# EasyEDA Pro project ProProject_ESP32-S3语音识别测试板_2023-11-30.epro

# Schematic S3版本验证-SCH
Create Date: 2023-11-21; Page Name: P1; Project Name: 物联网开关; Schematic Name: S3版本验证-SCH; Update Date: 2023-11-21; Drawed: Diam; Page Size: A4; Version: V1.0
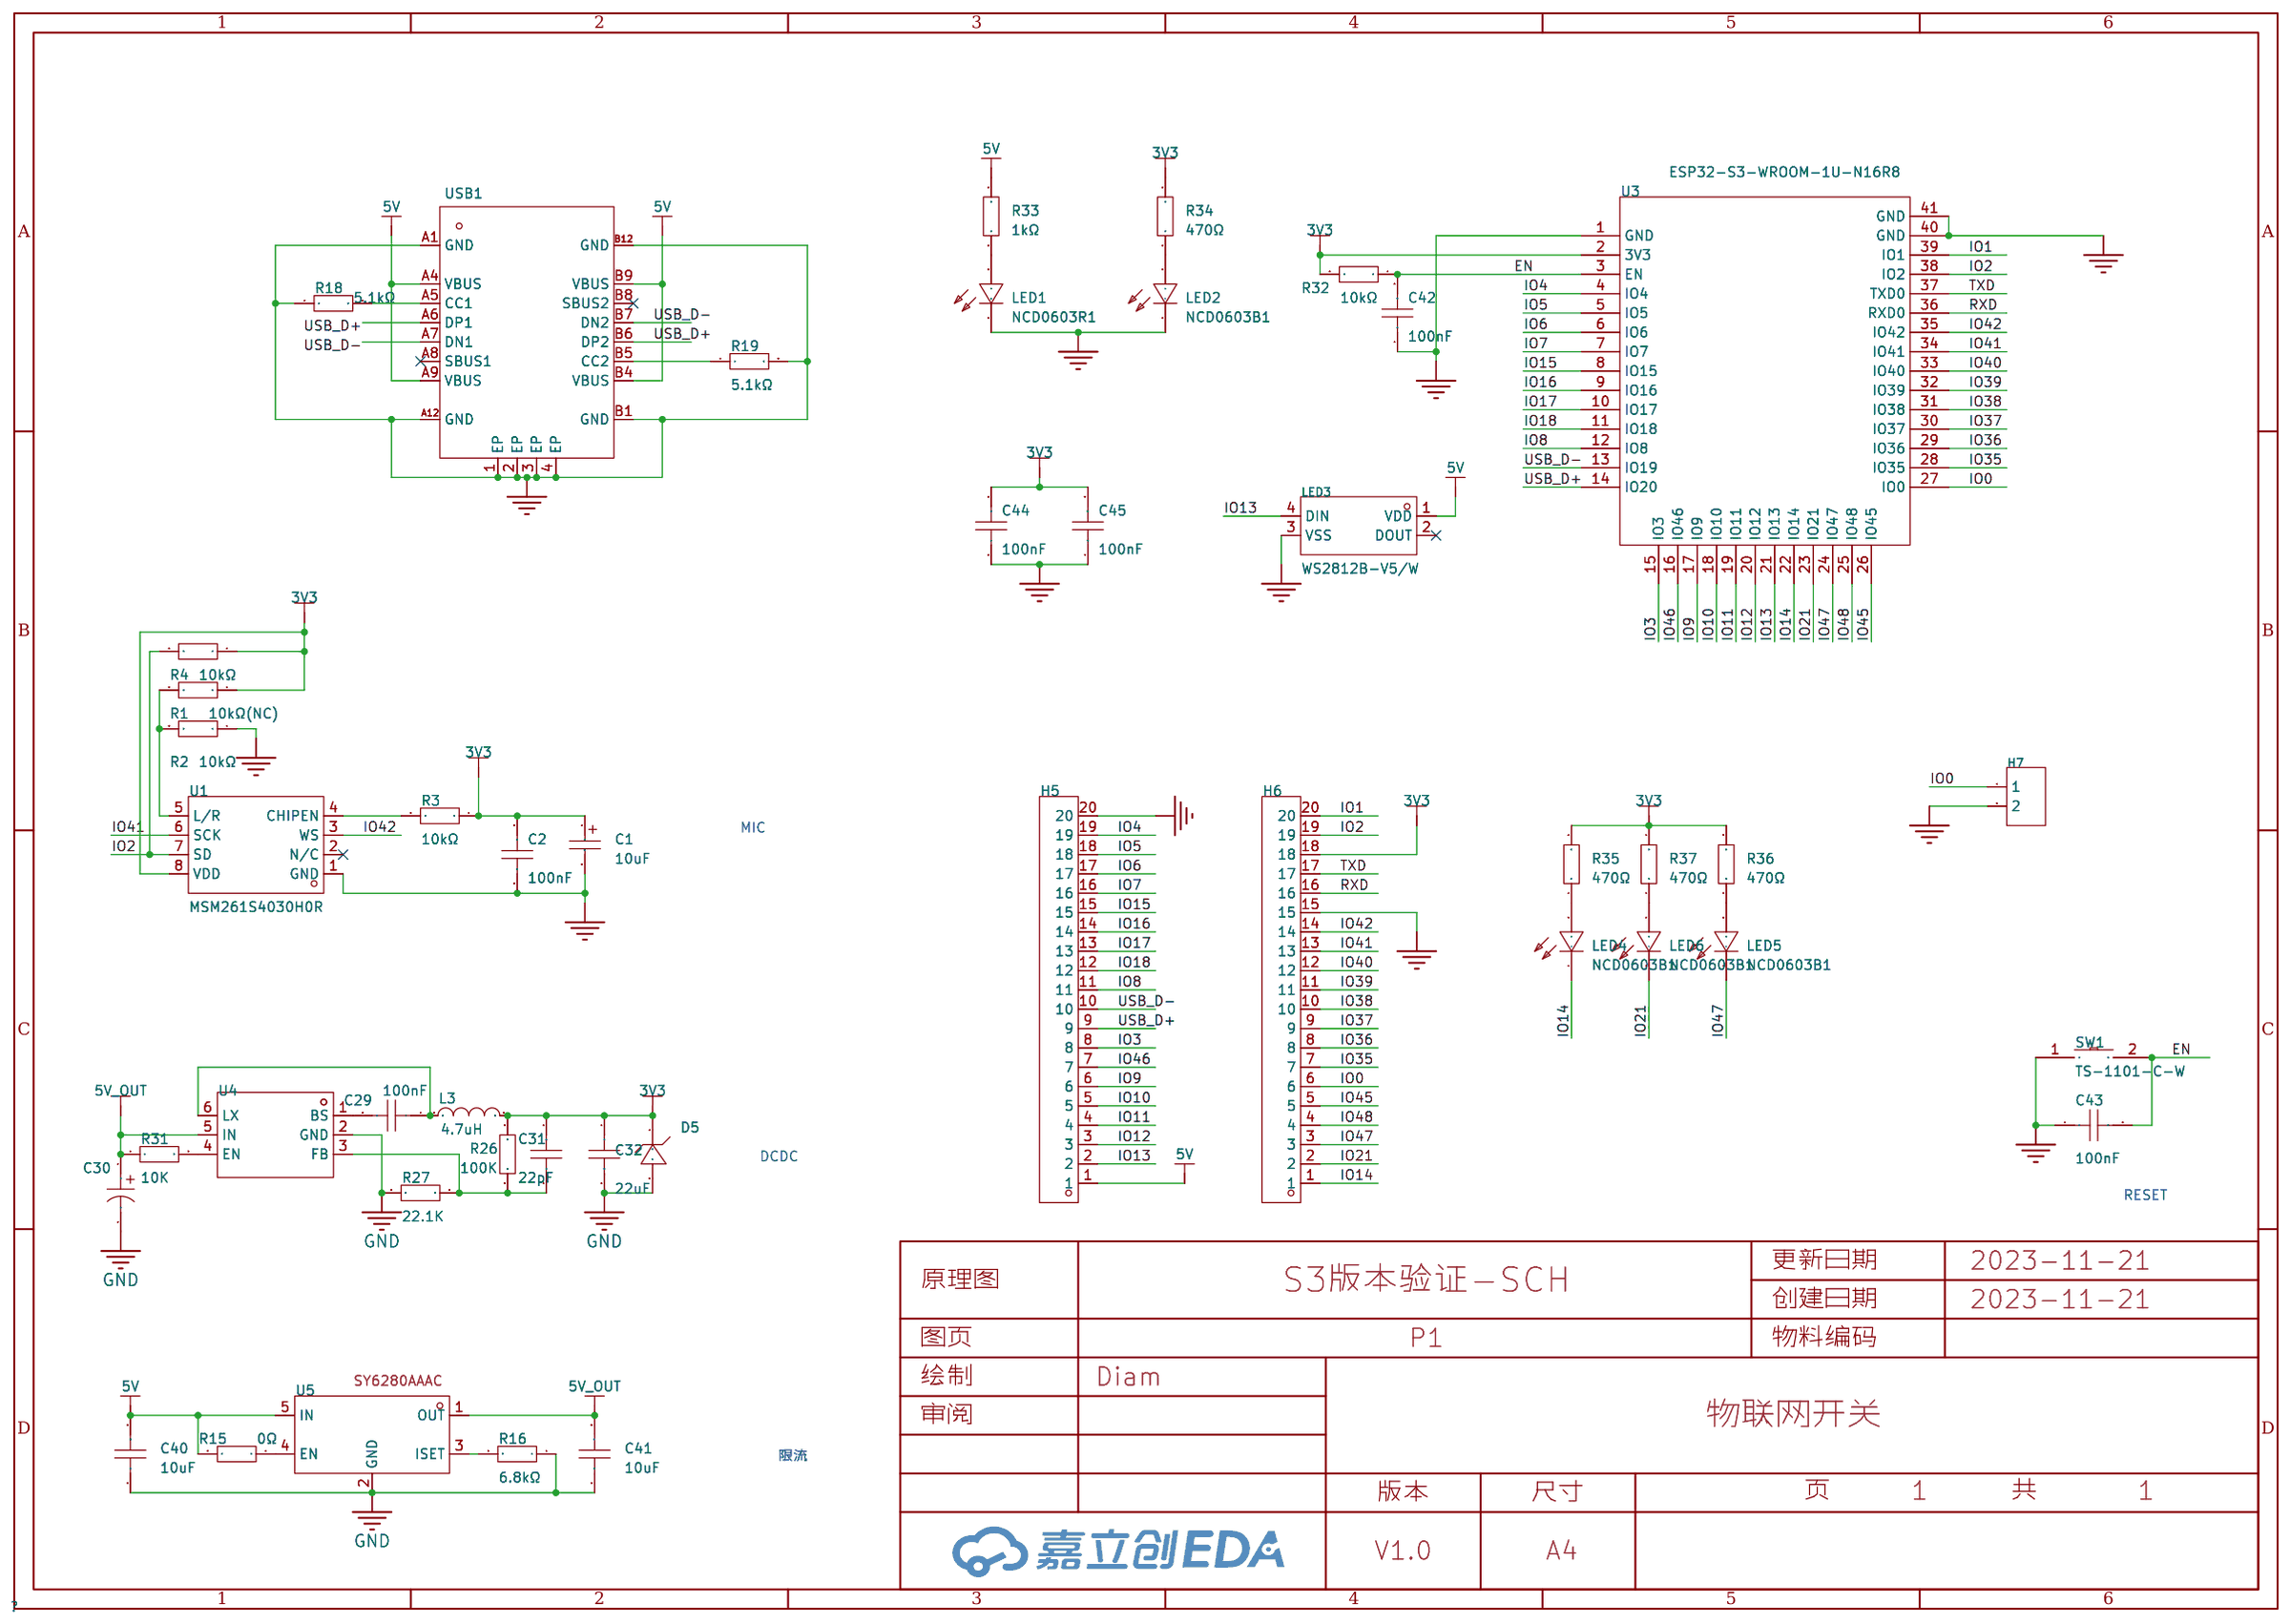
[diagram p0: schematic sheet]

## Parts
C1  10uF  [CASE-A_3216]
C2  100nF  [C0402]
C29  100nF  [c0402]
C30  4.7uF  [CAP-SMD_L3.2-W1.6-FD]
C31  22pF  [c0402]
C32  22uF  [c0402]
C40  10uF  [C0603]
C41  10uF  [C0603]
C42  100nF  [C0402]
C43  100nF  [C0402]
C44  100nF  [C0402]
C45  100nF  [C0402]
D5  BZT52B3V3  [SOD-123_L2.7-W1.6-LS3.7-RD]
H5  -  [HDR-TH_20P-P2.54-V-M-1]
H6  -  [HDR-TH_20P-P2.54-V-M-1]
H7  -  [HDR-TH_2P-P2.54-V-F]
L3  4.7uH  [IND-SMD_L4.5-W4.0-1]
LED1  NCD0603R1  [LED0603-RD_RED]
LED2  NCD0603B1  [LED0603-RD]
LED3  WS2812B-V5/W  [LED-SMD_4P-L5.0-W5.0-TL-1]
LED4  NCD0603B1  [LED0603-RD]
LED5  NCD0603B1  [LED0603-RD]
LED6  NCD0603B1  [LED0603-RD]
R1  10kΩ(NC)  [R0402]
R2  10kΩ  [R0402]
R3  10kΩ  [R0402]
R4  10kΩ  [R0402]
R15  0Ω  [R0402]
R16  6.8kΩ  [R0603]
R18  5.1kΩ  [R0402]
R19  5.1kΩ  [R0402]
R26  100K  [r0402]
R27  22.1K  [r0402]
R31  10K  [r0402]
R32  10kΩ  [R0402]
R33  1kΩ  [R0603]
R34  470Ω  [R0603]
R35  470Ω  [R0603]
R36  470Ω  [R0603]
R37  470Ω  [R0603]
SW1  TS-1101-C-W  [SW-SMD_L6.0-W3.3-LS8.0]
U1  MSM261S4030H0R  [LGA-8_L4.0-W3.0-P1.00-BL]
U3  ESP32-S3-WROOM-1U-N16R8  [WIRELM-SMD_ESP32-S3-WROOM-1U]
U4  SY8120B1ABC  [SOT-23-6_L2.9-W1.6-P0.95-LS2.8-BR]
U5  SY6280AAAC  [TSOT-23-5_L2.9-W1.6-P0.95-LS2.8-BL]
USB1  -  [USB_TYPE-C-16P]

## Library data of the parts
C1 = TAJA106K010RNJ: 容值:10uF;精度:±10%;额定电压:10V;等效串联电阻:3Ω@100kHz;; LCSC Part Name: 10uF ±10% 10V; Supplier Part: C7177; Manufacturer: Kyocera AVX; Supplier Footprint: CASE-A-3216; JLCPCB Part Class: Extended Part; Datasheet: https://atta.szlcsc.com/upload/public/pdf/source/20160107/1457707748330.pdf; Supplier: LCSC; Tolerance: ±10%; Rated Voltage: 10V; Equivalent Series Resistance(ESR): 3Ω@100kHz; Operating Temperature: -55℃~+125℃
C2 C42-C45 = GRM155R71C104KA88D: 容值:100nF;精度:±10%;额定电压:16V;材质(温度系数):X7R;; LCSC Part Name: 100nF ±10% 16V; Supplier Part: C71629; Manufacturer: muRata(村田); Supplier Footprint: 0402; JLCPCB Part Class: 扩展库; Datasheet: https://atta.szlcsc.com/upload/public/pdf/source/20161108/1478586448742.pdf; Supplier: LCSC; Tolerance: ±10%; Voltage Rated: 16V; Temperature Coefficient: X7R
C29 C31 C32 = CAP_0603: 容值:100nF;精度:±10%;额定电压:50V;温度系数:X7R;; Supplier Footprint: 0603
C30 = YH-475P/T-贴片钽电容: Supplier Part: C9900006332; Supplier Footprint: CAP-SMD_L3.2-W1.6; JLCPCB Part Class: ExtendedPart; Datasheet: https://atta.szlcsc.comnull; Supplier: LCSC
C40 C41 = CL10A106MA8NRNC: 容值:10uF;精度:±20%;额定电压:25V;材质(温度系数):X5R;; LCSC Part Name: 10uF ±20% 25V; Supplier Part: C96446; Manufacturer: SAMSUNG(三星); Supplier Footprint: 0603; JLCPCB Part Class: 基础库; Datasheet: https://atta.szlcsc.com/upload/public/pdf/source/20170325/1490427913016.pdf; Supplier: LCSC; Tolerance: ±20%; Voltage Rated: 25V; Temperature Coefficient: X5R
D5 = BZT52B3V3_C541632: 二极管配置:独立式;稳压值(标称值):3.3V;稳压值(范围):3.23V~3.37V;精度:-;功率:500mW;反向电流(Ir):5A@1V;阻抗(Zzt):95Ω;; LCSC Part Name: 3.3V500mW; Supplier Part: C541632; Manufacturer: AnBon(台湾安邦); Supplier Footprint: SOD-123; JLCPCB Part Class: ExtendedPart; Datasheet: https://atta.szlcsc.com/upload/public/pdf/source/20200522/C541631_BE0740C1D0B156F2BA05BAFDCAB7E32F.pdf; Supplier: LCSC; Diode Configuration: 独立式; Zener Voltage (Nom): 3.3V; Zener Voltage (Range): 3.23V~3.37V; Power Dissipation: 500mW; Reverse Leakage Current (Ir): 5A@1V; Zener Impedance (Zzt): 95Ω
H5 H6 = HDR-M_2.54_1x20P: 间距:2.54mm;总PIN位数:20;排数:1;插针结构:-;行距:-;安装类型:直插;圆针/方针:-;额定电流:-;额定电压:-;配合针长度:-;塑高:-;触头材质:黄铜;触头镀层:-;颜色:黑色;; Supplier Part: C50981; Supplier Footprint: 插件
H7 = HDR-F_2.54_1x2P: Supplier Part: C49661; Supplier Footprint: 插件
L3 = MCS0420-4R7MPN2: 电感值:4.7uH;精度:±20%;额定电流:2.2A;饱和电流(Isat):3.5A;直流电阻(DCR):98mΩ;; LCSC Part Name: 4.7uH±20%2.2A98mΩ; Supplier Part: C2937092; Manufacturer: PSA(信昌电陶); Supplier Footprint: 0420; JLCPCB Part Class: ExtendedPart; Datasheet: https://atta.szlcsc.com/upload/public/pdf/source/20220121/BD01ABADD177E465ADC6F87339B1CE90.pdf; Supplier: LCSC; Tolerance: ±20%; Rated Current: 2.2A; Saturation Current (Isat): 3.5A; DC Resistance (DCR): 98mΩ
LED1 = NCD0603R1_C84263: 发光颜色:红色;功率:65mW;透镜颜色:无色透明;主波长:615nm~630nm;发光强度:80mcd~220mcd;发光角度:130°;工作温度:-30℃~+85℃;; LCSC Part Name: 红灯 0603红灯   正贴; Supplier Part: C84263; Manufacturer: 国星光电; Supplier Footprint: 0603; JLCPCB Part Class: Extended Part; Datasheet: https://atta.szlcsc.com/upload/public/pdf/source/20200820/C84263_DABC6A75E58F576973B407FDBA283D60.pdf; Supplier: LCSC; Emitted Color: 红色; Forward Voltage (VF): 1.6V~2.6V; Forward Current: 20mA; Power Dissipation: 65mW; Lens Color: 无色透明; Dominant Wavelength: 615nm~630nm; Luminous Intensity: 80mcd~220mcd; Viewing Angle: 130°; Operating Temperature: -30℃~+85℃
LED2 LED4-LED6 = NCD0603B1: 发光颜色:蓝色;功率:72mW;透镜颜色:无色透明;主波长:463nm~475nm;发光强度:80mcd~220mcd;发光角度:130°;工作温度:-30℃~+85℃;; LCSC Part Name: 蓝灯 0603蓝灯   正贴; Supplier Part: C84266; Manufacturer: 国星光电; Supplier Footprint: 0603; JLCPCB Part Class: Extended Part; Datasheet: https://atta.szlcsc.com/upload/public/pdf/source/20200820/C84266_6A3CDBEFA72C6CAD68EDA53474ADAE6C.pdf; Supplier: LCSC; Emitted Color: 蓝色; Forward Voltage (VF): 2.6V~3.6V; Forward Current: 10mA; Power Dissipation: 72mW; Lens Color: 无色透明; Dominant Wavelength: 463nm~475nm; Luminous Intensity: 80mcd~220mcd; Viewing Angle: 130°; Operating Temperature: -30℃~+85℃
LED3 = WS2812B-V5/W: 无需外围元器件，有反接保护和过压保护，游乐设备，消费类电子，电竞领域，电脑周边及设备; LCSC Part Name: RGB三色 （注意防潮，请查阅规格书中对应具体内容）; Supplier Part: C2874885; Manufacturer: worldsemi; Supplier Footprint: SMD5050; JLCPCB Part Class: Extended Part; Datasheet: https://atta.szlcsc.com/upload/public/pdf/source/20220607/7C249E7978D02183621563743847A955.pdf; Supplier: LCSC
R1-R4 R32 = RC0402FR-0710KL: 电阻类型:厚膜电阻;阻值:10kΩ;精度:±1%;功率:62.5mW;; LCSC Part Name: 10kΩ ±1% 62.5mW; Supplier Part: C60490; Manufacturer: YAGEO(国巨); Supplier Footprint: 0402; JLCPCB Part Class: Extended Part; Datasheet: https://atta.szlcsc.com/upload/public/pdf/source/20170606/1496716515432.pdf; Supplier: LCSC; Type: 厚膜电阻; Tolerance: ±1%; Power(Watts): 62.5mW; Temperature Coefficient: ±100ppm/℃; Overload Voltage (Max): 50V; Operating Temperature Range: -55℃~+155℃
R15 = 0402WGJ0000TCE: 电阻类型:厚膜电阻;阻值:0Ω;精度:±5%;功率:62.5mW;; LCSC Part Name: 0Ω ±5% 62.5mW; Supplier Part: C21376; Manufacturer: UNI-ROYAL(厚声); Supplier Footprint: 0402; JLCPCB Part Class: 扩展库; Datasheet: https://atta.szlcsc.com/upload/public/pdf/source/20200306/C422600_1E6D84923E4A46A82E41ADD87F860B5C.pdf; Supplier: LCSC; Type: 厚膜电阻; Tolerance: ±5%; Power(Watts): 62.5mW; Overload Voltage (Max): 50V; Operating Temperature Range: -55℃~+155℃
R16 = 0603WAF6801T5E: 电阻类型:厚膜电阻;阻值:6.8kΩ;精度:±1%;功率:100mW;; LCSC Part Name: 6.8kΩ ±1% 100mW; Supplier Part: C23212; Manufacturer: UNI-ROYAL(厚声); Supplier Footprint: 0603; JLCPCB Part Class: 基础库; Datasheet: https://atta.szlcsc.com/upload/public/pdf/source/20200306/C422600_1E6D84923E4A46A82E41ADD87F860B5C.pdf; Supplier: LCSC; Type: 厚膜电阻; Tolerance: ±1%; Power(Watts): 100mW; Temperature Coefficient: ±100ppm/℃; Overload Voltage (Max): 75V; Operating Temperature Range: -55℃~+155℃
R18 R19 = 0402WGF5101TCE: 电阻类型:厚膜电阻;阻值:5.1kΩ;精度:±1%;功率:62.5mW;; LCSC Part Name: 5.1kΩ ±1% 62.5mW; Supplier Part: C25905; Manufacturer: UNI-ROYAL(厚声); Supplier Footprint: 0402; JLCPCB Part Class: Basic Part; Datasheet: https://atta.szlcsc.com/upload/public/pdf/source/20200306/C422600_1E6D84923E4A46A82E41ADD87F860B5C.pdf; Supplier: LCSC; Type: 厚膜电阻; Tolerance: ±1%; Power(Watts): 62.5mW; Temperature Coefficient: ±100ppm/℃; Overload Voltage (Max): 50V; Operating Temperature Range: -55℃~+155℃
R26 R27 R31 = Res_0603: Supplier Footprint: 0603
R33 = 0603WAF1001T5E: 电阻类型:厚膜电阻;阻值:1kΩ;精度:±1%;功率:100mW;温度系数:±100ppm/℃;; LCSC Part Name: 厚膜电阻 1kΩ ±1% 100mW; Supplier Part: C21190; Manufacturer: UNI-ROYAL(厚声); Supplier Footprint: 0603; JLCPCB Part Class: Basic Part; Datasheet: https://atta.szlcsc.com/upload/public/pdf/source/20200306/C422600_1E6D84923E4A46A82E41ADD87F860B5C.pdf; Supplier: LCSC; Type: 厚膜电阻; Tolerance: ±1%; Power(Watts): 100mW; Temperature Coefficient: ±100ppm/℃; Overload Voltage (Max): 75V; Operating Temperature Range: -55℃~+155℃
R34-R37 = 0603WAF4700T5E: 电阻类型:厚膜电阻;阻值:470Ω;精度:±1%;功率:100mW;温度系数:±100ppm/℃;; LCSC Part Name: 厚膜电阻 470Ω ±1% 100mW; Supplier Part: C23179; Manufacturer: UNI-ROYAL(厚声); Supplier Footprint: 0603; JLCPCB Part Class: Basic Part; Datasheet: https://atta.szlcsc.com/upload/public/pdf/source/20200306/C422600_1E6D84923E4A46A82E41ADD87F860B5C.pdf; Supplier: LCSC; Type: 厚膜电阻; Tolerance: ±1%; Power(Watts): 100mW; Temperature Coefficient: ±100ppm/℃; Overload Voltage (Max): 75V; Operating Temperature Range: -55℃~+155℃
SW1 = TS-1101-C-W: 电路结构:单刀单掷;带支架:否;触点电流:50mA;额定电压(AC):-;额定电压(DC):12V;额定功率:-;安装方式:立贴;绝缘电阻:-;带灯:无;作用力:260gf;机械寿命:5万次;; LCSC Part Name: 6*3.6*2.5mm 立贴 轻触开关 白色带淡绿按键 卷装; Supplier Part: C318938; Manufacturer: XKB Connectivity(中国星坤); Supplier Footprint: SMD; JLCPCB Part Class: Extended Part; Datasheet: https://atta.szlcsc.com/upload/public/pdf/source/20200227/C318938_C2E53B1EEDE37D980A33616AC086DE53.pdf; Supplier: LCSC; Circuit: 单刀单掷; Actuator Style: 矩形按钮; Switch Length: 6mm; Switch Width: 3.6mm; Switch Height: 2.5mm; Strike Gundam: 否; Contact Current: 50mA; Voltage Rating (DC): 12V; Mounting Style: 立贴; Actuator/Cap Color: 白色带淡绿; With Lamp: 无; Operating Force: 260gf; Mechanical Life: 5万次; Operating Temperature: -30℃~+85℃
U1 = MSM261S4030H0R: Supplier Part: C2840615; Supplier Footprint: LGA-8; JLCPCB Part Class: 扩展库; Datasheet: https://atta.szlcsc.com/upload/public/pdf/source/20210707/C2840615_6AE5BCBEE3224C96A8195D5DC270E7C8.pdf; Supplier: LCSC
U3 = ESP32-S3-WROOM-1U-N16R8: Supplier Part: C3013946; Manufacturer: ESPRESSIF(乐鑫); Supplier Footprint: SMD,18x19.2mm; JLCPCB Part Class: 扩展库; Supplier: LCSC
U4 = SY8120B1ABC: 功能类型:降压型;同步整流:-;输出通道数:-;拓扑结构:-;输入电压:-;输出电流(最大值):-;开关频率:-;; LCSC Part Name: 降压型; Supplier Part: C88474; Manufacturer: 矽力杰silergy; Supplier Footprint: SOT-23-6; JLCPCB Part Class: ExtendedPart; Datasheet: https://atta.szlcsc.com/upload/public/pdf/source/20170329/1490752188611.pdf; Supplier: LCSC; Function: 降压型
U5 = SY6280AAAC: Supplier Part: C207620; Manufacturer: silergy(矽力杰); Supplier Footprint: TSOT-23-5; JLCPCB Part Class: 扩展库; Datasheet: https://atta.szlcsc.com/upload/public/pdf/source/20180731/C207620_213C4AA0F820DFC4FB18E0BAA3E79F47.pdf; Supplier: LCSC
USB1 = USB_TYPE-C-16P: Supplier Footprint: SMD

## Nets
3V3: C1.1 C2.2 C31.2 C32.1 C44.2 C45.2 D5.1(C) H6.18 L3.2 R1.1 R3.1 R4.1 R26.2 R32.2 R34.1 R35.2 R36.2 R37.2 U1.8(VDD) U3.2(3V3)
5V: C40.2 H5.1 LED3.1(VDD) R15.2 R33.1 U5.5(IN) USB1.A4(VBUS) USB1.A9(VBUS) USB1.B4(VBUS) USB1.B9(VBUS)
5V_OUT: C30.1 C41.2 R31.1 U4.5(IN) U5.1(OUT)
GND: C1.2 C2.1 C30.2 C32.2 C40.1 C41.1 C42.1 C43.1 C44.1 C45.1 D5.2(A) H5.20 H6.15 H7.2 LED1.1(K) LED2.1(-) LED3.3(VSS) R2.1 R16.1 R18.1 R19.2 R27.2 SW1.1 U1.1(GND) U3.1(GND) U3.40(GND) U3.41(GND) U4.2(GND) U5.2(GND) USB1.1(EP) USB1.2(EP) USB1.3(EP) USB1.4(EP) USB1.A1(GND) USB1.A12(GND) USB1.B1(GND) USB1.B12(GND)
EN: C42.2 C43.2 R32.1 SW1.2 U3.3(EN)
IO0: H6.6 H7.1 U3.27(IO0)
IO1: H6.20 U3.39(IO1)
IO2: H6.19 R4.2 U1.7(SD) U3.38(IO2)
IO3: H5.8 U3.15(IO3)
IO4: H5.19 U3.4(IO4)
IO5: H5.18 U3.5(IO5)
IO6: H5.17 U3.6(IO6)
IO7: H5.16 U3.7(IO7)
IO8: H5.11 U3.12(IO8)
IO9: H5.6 U3.17(IO9)
IO10: H5.5 U3.18(IO10)
IO11: H5.4 U3.19(IO11)
IO12: H5.3 U3.20(IO12)
IO13: H5.2 LED3.4(DIN) U3.21(IO13)
IO14: H6.1 LED4.1(-) U3.22(IO14)
IO15: H5.15 U3.8(IO15)
IO16: H5.14 U3.9(IO16)
IO17: H5.13 U3.10(IO17)
IO18: H5.12 U3.11(IO18)
IO21: H6.2 LED6.1(-) U3.23(IO21)
IO35: H6.7 U3.28(IO35)
IO36: H6.8 U3.29(IO36)
IO37: H6.9 U3.30(IO37)
IO38: H6.10 U3.31(IO38)
IO39: H6.11 U3.32(IO39)
IO40: H6.12 U3.33(IO40)
IO41: H6.13 U1.6(SCK) U3.34(IO41)
IO42: H6.14 U1.3(WS) U3.35(IO42)
IO45: H6.5 U3.26(IO45)
IO46: H5.7 U3.16(IO46)
IO47: H6.3 LED5.1(-) U3.24(IO47)
IO48: H6.4 U3.25(IO48)
RXD: H6.16 U3.36(RXD0)
TXD: H6.17 U3.37(TXD0)
USB_D+: H5.9 U3.14(IO20) USB1.A6(DP1) USB1.B6(DP2)
USB_D-: H5.10 U3.13(IO19) USB1.A7(DN1) USB1.B7(DN2)
$1N522: R3.2 U1.4(CHIPEN)
$1N674: R1.2 R2.2 U1.5(L/R)
$1N1721: R31.2 U4.4(EN)
$1N1723: C31.1 R26.1 R27.1 U4.3(FB)
$1N1725: C29.1 L3.1 U4.6(LX)
$1N1726: C29.2 U4.1(BS)
$1N1944: R16.2 U5.3(ISET)
$1N1948: R15.1 U5.4(EN)
$1N2818: R18.2 USB1.A5(CC1)
$1N2825: R19.1 USB1.B5(CC2)
$1N4156: LED1.2(A) R33.2
$1N4310: LED2.2(+) R34.2
$1N4943: LED4.2(+) R35.1
$1N4945: LED6.2(+) R37.1
$1N4947: LED5.2(+) R36.1

Not connected (* = marked no-connect by the designer): LED3 2(DOUT)*; U1 2(N/C)*; USB1 A8(SBUS1)* B8(SBUS2)*

## Notes on the sheet
- MIC
- DCDC
- RESET
- 限流

# Board S3版本验证-PCB
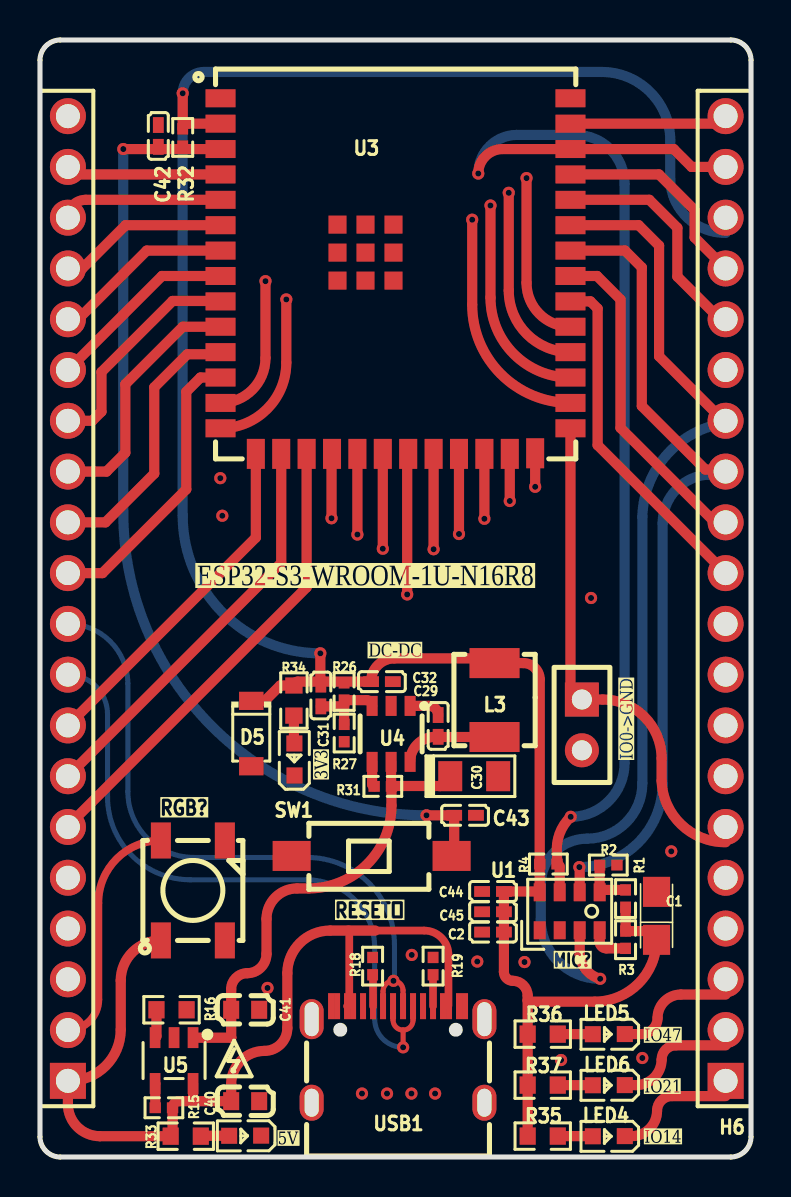
[diagram p1: board, top side]
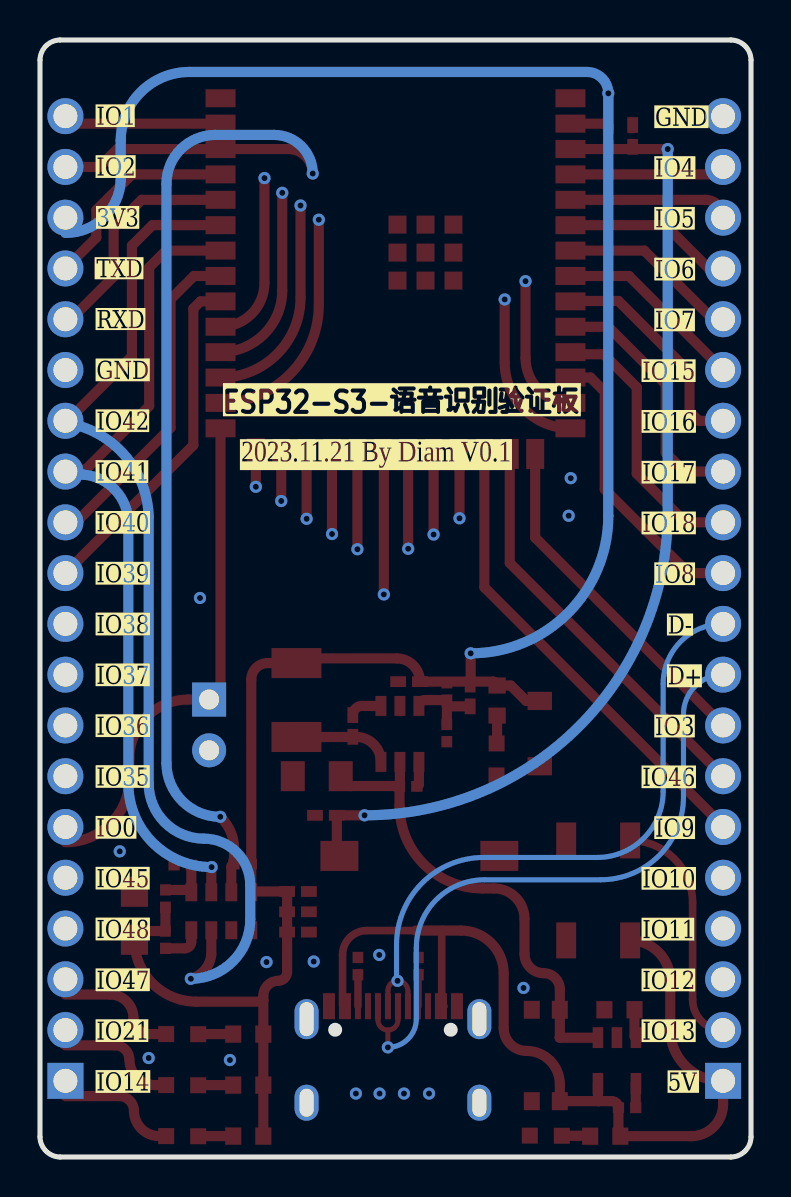
[diagram p2: board, bottom side, seen from below]

Outline 35.56 x 55.88 mm; copper layers: Top Layer, Inner1, Inner2, Bottom Layer. Coordinates in mm from the lower left corner of the outline.
Outline path: 0,54.86 0,1.02 arc(0.3,0.3) 1.02,0 34.54,0 arc(35.26,0.3) 35.56,1.02 35.56,54.86 arc(35.26,55.58) 34.54,55.88 1.02,55.88 arc(0.3,55.58) 0,54.86
Stack: Top Layer 0.035mm 外层铜厚1oz / Dielectric1 0.2104mm 7628 RC49% 8.6mil / Inner1 0.0152mm 内层铜厚 / Dielectric2 1.065mm 1.1mm H/HOZ 含铜 / Inner2 0.0152mm 内层铜厚 / Dielectric3 0.2104mm 7628 RC49% 8.6mil / Bottom Layer 0.035mm 外层铜厚1oz

## Design rules (mm)
template: 自定义配置
spacing copperThickness1oz (default): track to track 0.102, other pairs 0.051 to 0.3
spacing copperThickness2oz: track to track 0.203, other pairs 0.051 to 0.3
track width copperThickness1oz (default): min 0.127, default 0.254, max 2.54
track width copperThickness2oz: min 0.203, default 0.254, max 2.54
differential pair differentialPair (default): width min 0.127, default 0.254, max 2.54; gap min 0.152, default 0.152
via viaSize (default): diameter min 0.399, default 0.61, max 10; hole min 0.249, default 0.305, max 6.299
net GND uses copperRegion1
pour e1856 uses copperRegion1
pour e1675 uses copperRegion1
pour e2037 uses copperRegion1
pour e2623 uses copperRegion

## Placement (name value [footprint] x y rotation side)
C1  10uF  [CASE-A_3216]  30.84 12.06 90 top
C2  100nF  [C0402]  22.66 11.25 0 top
C29  100nF  [c0402]  19.91 21.56 90 top
C30  4.7uF  [CAP-SMD_L3.2-W1.6-FD]  21.72 19.05 0 top
C31  22pF  [c0402]  14.05 23.09 90 top
C32  22uF  [c0402]  17.1 23.78 0 top
C40  10uF  [C0603]  10.26 2.79 180 top
C41  10uF  [C0603]  10.26 7.37 180 top
C42  100nF  [C0402]  5.92 51.08 270 top
C43  100nF  [C0402]  21.26 17.09 180 top
C44  100nF  [C0402]  22.66 13.28 0 top
C45  100nF  [C0402]  22.66 12.27 0 top
D5  BZT52B3V3  [SOD-123_L2.7-W1.6-LS3.7-RD]  10.57 21.18 270 top
H5  -  [HDR-TH_20P-P2.54-V-M-1]  1.4 27.94 90 top
H6  -  [HDR-TH_20P-P2.54-V-M-1]  34.29 27.94 90 top
H7  -  [HDR-TH_2P-P2.54-V-F]  27.1 21.62 270 top
L3  4.7uH  [IND-SMD_L4.5-W4.0-1]  22.73 22.86 90 top
LED1  NCD0603R1  [LED0603-RD_RED]  10.26 1.07 180 top
LED2  NCD0603B1  [LED0603-RD]  12.73 19.89 90 top
LED3  WS2812B-V5/W  [LED-SMD_4P-L5.0-W5.0-TL-1]  7.65 13.33 90 top
LED4  NCD0603B1  [LED0603-RD]  28.45 1.04 180 top
LED5  NCD0603B1  [LED0603-RD]  28.45 6.15 180 top
LED6  NCD0603B1  [LED0603-RD]  28.45 3.59 180 top
R1  10kΩ(NC)  [R0402]  29.29 12.93 90 top
R2  10kΩ  [R0402]  28.42 14.6 180 top
R3  10kΩ  [R0402]  29.29 10.87 270 top
R4  10kΩ  [R0402]  25.43 14.66 0 top
R15  0Ω  [R0402]  6.2 2.46 0 top
R16  6.8kΩ  [R0603]  6.58 7.37 180 top
R18  5.1kΩ  [R0402]  16.64 9.55 270 top
R19  5.1kΩ  [R0402]  19.66 9.55 90 top
R26  100K  [r0402]  15.21 23.29 90 top
R27  22.1K  [r0402]  15.21 21.21 270 top
R31  10K  [r0402]  17.15 18.54 180 top
R32  10kΩ  [R0402]  7.14 51 90 top
R33  1kΩ  [R0603]  7.29 1.04 0 top
R34  470Ω  [R0603]  12.7 22.83 270 top
R35  470Ω  [R0603]  25.14 1.05 180 top
R36  470Ω  [R0603]  25.14 6.15 180 top
R37  470Ω  [R0603]  25.14 3.6 180 top
SW1  TS-1101-C-W  [SW-SMD_L6.0-W3.3-LS8.0]  16.59 15.06 0 top
U1  MSM261S4030H0R  [LGA-8_L4.0-W3.0-P1.00-BL]  26.49 12.29 0 top
U3  ESP32-S3-WROOM-1U-N16R8  [WIRELM-SMD_ESP32-S3-WROOM-1U]  17.78 44.07 0 top
U4  SY8120B1ABC  [SOT-23-6_L2.9-W1.6-P0.95-LS2.8-BR]  17.56 21.17 90 top
U5  SY6280AAAC  [TSOT-23-5_L2.9-W1.6-P0.95-LS2.8-BL]  6.71 4.83 180 top
USB1  -  [USB_TYPE-C-16P]  17.78 5.13 0 top

## Footprints (pads in the part's own frame, mm; a bottom-side part is the same pattern mirrored in y, then rotated)
c0402
  rect 0.79x0.54 smd: 1(-0.545,0) 2(0.545,0)
C0402
  rect 0.79x0.54 smd: 1(-0.545,0) 2(0.545,0)
C0603
  rect 0.8x0.9 smd: 1(-0.7,0) 2(0.7,0)
CAP-SMD_L3.2-W1.6-FD
  rect 1.199x1.501 smd: 1(-1.199,0) 2(1.199,0)
CASE-A_3216
  rect 1.5x1.359 smd: 1(-1.2,0) 2(1.2,0)
HDR-TH_2P-P2.54-V-F
  rect 1.7x1.7 hole 1: 1(-1.27,0)
  round 1.7 hole 1: 2(1.27,0)
HDR-TH_20P-P2.54-V-M-1
  rect 1.8x1.8 hole 1.2: 1(-24.13,0)
  round 1.8 hole 1.2: 2(-21.59,0) 3(-19.05,0) 4(-16.51,0) 5(-13.97,0) 6(-11.43,0) 7(-8.89,0) 8(-6.35,0) 9(-3.81,0) 10(-1.27,0) 11(1.27,0) 12(3.81,0) 13(6.35,0) 14(8.89,0) 15(11.43,0) 16(13.97,0) 17(16.51,0) 18(19.05,0) 19(21.59,0) 20(24.13,0)
IND-SMD_L4.5-W4.0-1
  rect 1.501x2.499 smd: 1(-1.849,0) 2(1.849,0)
LED0603-RD
  rect 0.8x0.8 smd: 1(-0.799,-0.004) 2(0.799,0.004)
LED0603-RD_RED
  rect 0.8x0.8 smd: 1(-0.799,-0.004) 2(0.799,0.004)
LED-SMD_4P-L5.0-W5.0-TL-1
  rect 1.8x1 smd: 1(-2.5,1.6) 2(-2.5,-1.6) 3(2.5,-1.6) 4(2.5,1.6)
LGA-8_L4.0-W3.0-P1.00-BL
  rect 0.6x0.9 smd: 1(-1.5,-0.95) 2(-0.5,-0.95) 3(0.5,-0.95) 4(1.5,-0.95) 5(1.5,0.95) 6(0.5,0.95) 7(-0.5,0.95) 8(-1.5,0.95)
r0402
  rect 0.566x0.54 smd: 1(-0.433,0) 2(0.433,0)
R0402
  rect 0.566x0.54 smd: 1(-0.433,0) 2(0.433,0)
R0603
  rect 0.806x0.864 smd: 1(-0.753,0) 2(0.753,0)
SOD-123_L2.7-W1.6-LS3.7-RD
  rect 0.91x1.22 smd: 1(-1.635,0) 2(1.635,0)
SOT-23-6_L2.9-W1.6-P0.95-LS2.8-BR
  rect 1x0.55 smd: 1(1.4,-0.95) 2(1.4,0) 3(1.4,0.95) 4(-1.4,0.95) 5(-1.4,0) 6(-1.4,-0.95)
SW-SMD_L6.0-W3.3-LS8.0
  rect 1.9x1.5 smd: 1(-4,0) 2(4,0)
TSOT-23-5_L2.9-W1.6-P0.95-LS2.8-BL
  rect 0.532x1.045 smd: 1(-0.95,-1.147) 2(0,-1.147) 3(0.95,-1.147) 4(0.95,1.147) 5(-0.95,1.147)
USB_TYPE-C-16P
  oval 1.2x2 hole 0.7x1.7: 1(-4.193,1.765) 2(4.447,1.765)
  oval 1.2x1.8 hole 0.7x1.4: 3(-4.193,-2.415) 4(4.447,-2.415)
  rect 0.3x1.3 smd: A1(-3.223,2.415) A4(-2.423,2.415) A5(-1.123,2.415) A6(-0.123,2.415) A7(0.377,2.415) A8(1.377,2.415) A9(2.677,2.415) A12(3.477,2.415) B1(3.177,2.415) B4(2.377,2.415) B5(1.877,2.415) B6(0.877,2.415) B7(-0.623,2.415) B8(-1.623,2.415) B9(-2.123,2.415) B12(-2.923,2.415)
WIRELM-SMD_ESP32-S3-WROOM-1U
  rect 1.5x0.9 smd: 1(-8.75,8.895) 2(-8.75,7.625) 3(-8.75,6.355) 4(-8.75,5.085) 5(-8.75,3.815) 6(-8.75,2.545) 7(-8.75,1.275) 8(-8.75,0.005) 9(-8.75,-1.265) 10(-8.75,-2.535) 11(-8.75,-3.805) 12(-8.75,-5.075) 13(-8.75,-6.345) 14(-8.75,-7.615) 27(8.75,-7.615) 28(8.75,-6.345) 29(8.75,-5.075) 30(8.75,-3.805) 31(8.75,-2.535) 32(8.75,-1.265) 33(8.75,0.005) 34(8.75,1.275) 35(8.75,2.545) 36(8.75,3.815) 37(8.75,5.085) 38(8.75,6.355) 39(8.75,7.625) 40(8.75,8.895)
  rect 0.9x1.5 smd: 15(-6.985,-8.895) 16(-5.715,-8.895) 17(-4.445,-8.895) 18(-3.175,-8.895) 19(-1.905,-8.895) 20(-0.635,-8.895) 21(0.635,-8.895) 22(1.905,-8.895) 23(3.175,-8.895) 24(4.445,-8.895) 25(5.715,-8.895) 26(6.985,-8.865)
  rect 0.9x0.9 smd: 41(-2.9,2.575) 41(-2.9,1.175) 41(-2.9,-0.225) 41(-1.5,2.575) 41(-1.5,1.175) 41(-1.5,-0.225) 41(-0.1,2.575) 41(-0.1,1.175) 41(-0.1,-0.225)

## Nets
As in the schematic.

Pads without a net: LED3 2; U1 2; USB1 A8 B8

## Via types
v1: diameter 0.61, hole 0.305, Top Layer to Bottom Layer, 39 vias

## Routing (per net, layer and track width the routed paths; a pad name or vN(x,y) marks a point on that pad's centre or on a via; arc(x,y) is an arc through that point)
3V3: length 123.2
  Top Layer w0.508: R1.1 R3.1 30.4,11.3 arc(30.71,11.18) C1.1 arc(29.93,8.68) 27.74,7.77 24.46,7.77 arc(24.41,7.79) 24.39,7.84 ; 14.02,23.78 16.56,23.78 arc(16.9,24.6) 17.72,24.94 22.5,24.94 arc(22.66,24.87) 22.73,24.71 24.17,24.71 arc(24.75,24.47) 24.99,23.89 R4.1 U1.8 arc(24.98,13.27) 24.95,13.28 C44.2 C45.2 C2.2 23.2,9.26 arc(23.33,8.94) 23.65,8.81 arc(24.17,8.6) 24.39,8.07 24.39,7.84 ; 14.02,23.78 12.89,23.78 arc(12.76,23.73) R34.1 12.01,23.59 11.24,22.82 D5.1 ; 14.02,23.78 v1(14.02,25.2) ; 14.02,23.78 14.02,23.66 arc(14.03,23.64) C31.2 ; 24.39,7.84 R36.2 R37.2 R35.2 ; v1(7.14,53.21) R32.2 arc(7.21,51.62) 7.4,51.69 U3.2
  Bottom Layer w0.508: 34.29,46.23 arc(32.37,46.99) 31.52,48.87 31.52,50.85 arc(30.52,53.28) 28.09,54.28 8.2,54.28 arc(7.45,53.97) v1(7.14,53.21) 7.14,32.08 arc(9.15,27.21) v1(14.02,25.2)
5V: length 46.8
  Top Layer w0.381: 20.43,7.57 20.43,10.11 arc(20.07,10.97) 19.21,11.33 16.76,11.33 ; 15.43,11.33 arc(15.46,11.32) 15.47,11.29 15.47,7.66 arc(15.44,7.58) USB1.A4
  Top Layer w0.508: U5.5 7.66,2.82 arc(7.65,2.8) 7.63,2.79 ; 16.76,11.33 14.51,11.33 arc(13,10.7) 12.37,9.19 12.37,6.45 arc(12.04,5.64) 11.23,5.31 arc(10.05,4.82) 9.56,3.64 C40.2 7.63,2.79 ; 7.63,2.79 6.96,2.79 arc(6.73,2.7) R15.2 6.63,1.14 arc(6.6,1.07) R33.1 3,1.04 arc(1.87,1.51) 1.4,2.64 H5.1 1.47,3.81 arc(3.29,4.56) 4.04,6.38 4.04,8.83 arc(4.63,10.25) LED3.1
5V_OUT: length 23.8
  Top Layer w0.508: U4.5 17.56,18.56 ; 17.56,18.56 20.03,18.56 arc(20.37,18.7) C30.1 ; 17.56,18.56 arc(17.57,18.55) R31.1 17.58,17.58 arc(16.36,14.65) 13.44,13.44 12.85,13.44 arc(11.77,12.99) 11.33,11.91 11.33,10.16 arc(11.05,9.48) 10.36,9.19 arc(9.8,8.96) 9.56,8.39 C41.2 9.56,5.97 arc(9.56,5.97) 9.57,5.97 7.66,5.97 arc(7.66,5.97) U5.1
GND:
  vias: v1(9.02,33.96) v1(9.12,32.08) v1(11.38,8.46) v1(16.1,3.17) v1(17.36,3.17) v1(18.59,10.11) v1(18.58,3.17) v1(19.76,3.17) v1(21.87,9.78) v1(24.23,9.75) v1(26.06,4.85) v1(27.56,27.97) v1(30.12,4.95) v1(31.57,15.29)
EN: length 50.5
  Top Layer w0.508: U3.3 6.03,50.42 ; 6.03,50.42 v1(4.17,50.42) ; 6.03,50.42 arc(5.95,50.46) C42.2 ; v1(19.33,17.09) 20.71,17.09 20.71,15.19 arc(20.68,15.1) SW1.2
  Bottom Layer w0.508: v1(4.17,50.42) 4.17,32.26 arc(8.61,21.54) v1(19.33,17.09)
IO0: length 25.6
  Top Layer w0.508: U3.27 26.53,23.46 arc(26.7,23.05) H7.1 28.14,22.89 arc(30.23,22.02) 31.09,19.94 31.09,18.82 arc(32.07,16.64) 34.29,15.75
IO1: length 7.9
  Top Layer w0.508: U3.39 33.91,51.69 H6.20
IO2: length 60.5
  Top Layer w0.508: U1.7 25.99,14.52 arc(25.95,14.62) R4.2 25.86,15.16 arc(25.98,16.17) v1(26.54,17.02) ; H6.19 32.59,49.53 31.69,50.42 U3.38 23.14,50.42 arc(22.28,50.07) v1(21.92,49.2)
  Bottom Layer w0.508: v1(21.92,49.2) arc(22.49,50.57) 23.85,51.13 26.8,51.13 arc(28.52,50.42) 29.24,48.69 29.24,19.71 arc(28.45,17.81) v1(26.54,17.02)
IO3: length 17.5
  Top Layer w0.508: U3.15 10.79,30.99 H5.8
IO4: length 7.8
  Top Layer w0.508: U3.4 1.77,49.15 arc(1.51,49.26) H5.19
IO5: length 8.1
  Top Layer w0.508: U3.5 2.29,47.88 arc(1.66,47.62) H5.18
IO6: length 8.5
  Top Layer w0.508: H5.17 2.12,44.45 4.28,46.61 U3.6
IO7: length 9.1
  Top Layer w0.508: H5.16 1.91,41.91 5.34,45.34 U3.7
IO8: length 14.5
  Top Layer w0.508: U3.12 8.03,38.99 7.31,38.28 7.31,33.4 3.12,29.21 H5.11
IO9: length 23.6
  Top Layer w0.508: U3.17 13.34,28.5 1.4,16.56 H5.6
IO10: length 28.9
  Top Layer w0.508: v1(14.58,31.95) 14.58,35.15 U3.18
  Inner2 w0.508: v1(14.58,31.95) 14.19,31.95 arc(9.94,30.19) 8.18,25.94 8.18,20.75 arc(6.19,15.96) H5.5
IO11: length 32.6
  Top Layer w0.508: v1(15.88,31.14) U3.19
  Inner2 w0.508: v1(15.88,31.14) 14.5,31.14 arc(10.73,29.58) 9.17,25.81 9.17,19.2 arc(6.89,13.71) H5.4
IO12: length 36.4
  Top Layer w0.508: v1(17.15,30.43) U3.20
  Inner2 w0.508: H5.3 arc(7.72,11.51) 10.34,17.83 10.34,26.14 arc(11.53,29.01) 14.4,30.2 16.92,30.2 arc(17.08,30.27) v1(17.15,30.43)
IO13: length 52.7
  Top Layer w0.381: H5.2 arc(2.47,6.8) 2.92,7.87 2.92,12.71 arc(3.84,14.92) LED3.4
  Top Layer w0.508: U3.21 18.36,35.12 v1(18.36,28.14)
  Inner2 w0.508: v1(18.36,28.14) 13.64,28.14 arc(12.1,27.5) 11.46,25.96 11.46,16.41 arc(8.51,9.3) H5.2
IO14: length 48.5
  Top Layer w0.508: 34.29,3.05 31.6,3.05 arc(31.08,2.83) 30.86,2.31 arc(30.49,1.42) 29.59,1.04 LED4.1 ; U3.22 v1(19.69,30.4)
  Inner2 w0.508: H6.1 28.14,3.81 arc(27.33,4.14) 27,4.95 27,5.26 arc(26.8,5.74) 26.31,5.94 arc(24.19,6.82) 23.32,8.94 23.32,10.57 arc(23.09,11.12) 22.53,11.35 arc(22.08,11.54) 21.9,11.99 21.9,28.19 arc(21.25,29.76) v1(19.69,30.4)
IO15: length 9.6
  Top Layer w0.508: U3.8 6.1,44.07 H5.15
IO16: length 11.3
  Top Layer w0.508: H5.14 2.62,36.83 3.07,37.29 3.07,39.27 6.63,42.82 9.01,42.82 U3.9
IO17: length 12.6
  Top Layer w0.508: U3.10 7.14,41.53 4.27,38.66 4.27,35.23 3.33,34.29 H5.13
IO18: length 13.7
  Top Layer w0.508: H5.12 3.28,31.75 5.72,34.19 5.72,38.51 7.37,40.16 8.92,40.16 U3.11
IO21: length 44.4
  Top Layer w0.508: U3.23 v1(20.96,31.17) ; 34.29,5.59 31.8,5.59 arc(31.3,5.38) 31.09,4.88 arc(30.71,3.97) 29.81,3.6 LED6.1
  Inner2 w0.508: H6.2 30.15,6.35 arc(27.11,7.61) 25.86,10.64 arc(25.43,11.68) 24.38,12.12 arc(23.47,12.49) 23.09,13.41 23.09,29.03 arc(22.46,30.54) v1(20.96,31.17)
IO35: length 48.8
  Top Layer w0.508: v1(21.62,46.89) 21.62,42.64 arc(23.05,39.16) U3.28
  Inner2 w0.508: H6.7 33.4,19.05 arc(30.72,20.16) 29.62,22.83 29.62,42.04 arc(29.18,43.1) 28.12,43.54 24.97,43.54 arc(22.6,44.52) v1(21.62,46.89)
IO36: length 45.3
  Top Layer w0.508: v1(22.53,47.6) 22.53,42.99 arc(23.7,40.17) U3.29
  Inner2 w0.508: H6.8 33.4,21.59 arc(31.43,22.41) 30.61,24.38 30.61,42.52 arc(30.06,43.85) 28.73,44.4 25.73,44.4 arc(23.47,45.34) v1(22.53,47.6)
IO37: length 41.5
  Top Layer w0.508: v1(23.44,48.23) 23.44,43.35 arc(24.35,41.17) U3.30
  Inner2 w0.508: H6.9 33.4,24.13 arc(32.14,24.65) 31.62,25.91 31.62,42.67 arc(30.82,44.61) 28.88,45.41 26.26,45.41 arc(24.27,46.24) v1(23.44,48.23)
IO38: length 37.6
  Top Layer w0.508: v1(24.33,48.97) 24.33,43.73 arc(24.98,42.18) U3.31
  Inner2 w0.508: H6.10 34.23,26.67 arc(33.07,27.15) 32.59,28.31 32.59,42.93 arc(31.56,45.4) 29.08,46.43 26.87,46.43 arc(25.08,47.17) v1(24.33,48.97)
IO39: length 17.4
  Top Layer w0.508: U3.32 27.53,42.8 27.89,42.44 27.89,35.61 H6.11
IO40: length 16.6
  Top Layer w0.508: H6.12 33.76,31.75 29.03,36.47 29.03,42.9 27.86,44.07 U3.33
IO41: length 41.8
  Top Layer w0.508: U1.6 26.99,14.49 arc(26.99,14.5) v1(26.97,14.5) ; H6.13 34.19,34.39 33.27,34.39 30.1,37.57 30.1,44.5 29.26,45.34 U3.34
  Bottom Layer w0.508: 34.29,34.21 33.38,34.14 arc(31.78,33.35) 31.14,31.7 31.14,18.67 arc(29.92,15.72) v1(26.97,14.5)
IO42: length 52.5
  Top Layer w0.508: U1.3 26.99,10.14 arc(27.31,9.37) v1(28.02,8.92) ; H6.14 34.19,36.83 30.96,40.06 30.96,45.59 29.94,46.61 U3.35
  Bottom Layer w0.508: 34.32,36.73 arc(31.36,35.15) 30.12,32.03 30.12,18.69 arc(29.32,16.74) 27.36,15.93 arc(25.72,15.25) 25.04,13.61 25.04,11.89 arc(25.91,9.79) v1(28.02,8.92)
IO45: length 27.1
  Top Layer w0.508: 24.76,35.2 v1(24.76,33.53)
  Inner2 w0.508: H6.5 33.4,13.97 arc(30.02,15.37) 28.63,18.74 28.63,29.67 arc(27.5,32.4) v1(24.76,33.53)
IO46: length 20.5
  Top Layer w0.508: U3.16 12.06,29.72 H5.7
IO47: length 39.7
  Top Layer w0.508: U3.24 v1(22.22,31.93) ; 34.29,8.13 32.06,8.13 arc(31.23,7.79) 30.89,6.96 arc(30.65,6.39) 30.08,6.15 LED5.1
  Inner2 w0.508: H6.3 33.4,8.89 arc(27.03,11.53) 24.38,17.91 24.38,29.77 arc(23.75,31.3) v1(22.22,31.93)
IO48: length 31.3
  Top Layer w0.508: U3.25 v1(23.5,32.82)
  Inner2 w0.508: v1(23.5,32.82) arc(25.08,32.16) 25.73,30.58 25.73,19.1 arc(26.05,18.33) 26.82,18.01 26.92,18.01 arc(27.59,17.73) 27.86,17.07 27.86,14.81 arc(28.79,12.58) 31.01,11.66 34.06,11.66 arc(34.22,11.59) H6.4
RXD: length 11.7
  Top Layer w0.508: H6.16 34.01,41.91 31.88,44.04 31.88,46.48 30.47,47.88 U3.36
TXD: length 10.5
  Top Layer w0.508: H6.17 32.74,46 32.74,47.37 30.96,49.15 U3.37
USB_D+: length 69.5
  Top Layer w0.254: 18.16,6.35 v1(18.16,5.49) ; 18.16,6.35 arc(18.51,6.5) 18.66,6.85 USB1.B6 ; 18.16,6.35 arc(17.8,6.5) 17.66,6.85 USB1.A6
  Top Layer w0.508: v1(12.32,42.9) 12.32,39.74 arc(11.36,37.42) U3.14
  Inner2 w0.508: v1(12.32,42.9) 8.48,42.9 arc(7.41,42.45) 6.96,41.38 6.96,29.69 arc(5.33,25.76) H5.9
  Bottom Layer w0.254: H5.9 arc(2.8,23.55) 3.38,22.15 3.38,18.02 arc(4.59,15.08) 7.53,13.87 13.34,13.87 arc(15.74,12.87) 16.74,10.46 16.74,6.91 arc(17.16,5.9) v1(18.16,5.49)
USB_D-: length 64.4
  Top Layer w0.254: USB1.B7 17.16,8.29 arc(17.31,8.66) v1(17.68,8.81) arc(18.02,8.67) 18.16,8.34 USB1.A7
  Top Layer w0.508: v1(11.28,43.81) 11.28,39.97 arc(10.62,38.38) U3.13
  Inner2 w0.508: v1(11.28,43.81) 7.7,43.81 arc(6.17,43.18) 5.54,41.66 5.54,30.81 arc(4.32,27.88) H5.10
  Bottom Layer w0.254: H5.10 arc(3.52,25.79) 4.39,23.67 4.39,18.29 arc(5.36,15.95) 7.7,14.99 13.36,14.99 arc(16.45,13.71) 17.73,10.62 17.73,8.86 arc(17.71,8.83) v1(17.68,8.81)
$1N522: length 2.1
  Top Layer w0.508: R3.2 28.32,10.44 arc(28.09,10.54) 27.99,10.77 27.99,11.34
$1N674: length 2.7
  Top Layer w0.508: R2.2 27.99,13.48 arc(28.03,13.4) 28.11,13.36 ; R1.2 28.11,13.36 ; 28.11,13.36 arc(28.03,13.33) U1.5
$1N1721: length 1.3
  Top Layer w0.508: U4.4 16.61,18.64 arc(16.64,18.57) R31.2
$1N1723: length 3.9
  Top Layer w0.508: 15.21,22.54 R26.1 16.32,22.86 arc(16.53,22.77) U4.3 ; 15.21,22.54 C31.1 ; 15.21,22.54 15.21,21.65 arc(15.21,21.64) R27.1
$1N1725: length 4.9
  Top Layer w0.508: L3.1 19.92,21.01 arc(19.92,21.01) C29.1 19.76,21.02 arc(18.88,20.65) U4.6
$1N1726: length 1.7
  Top Layer w0.508: U4.1 19.46,22.57 arc(19.78,22.43) C29.2
$1N1944: length 1.4
  Top Layer w0.508: R16.2 5.82,6.04 arc(5.8,5.99) U5.3
$1N1948: length 1.2
  Top Layer w0.508: R15.1 5.76,3.67 arc(5.76,3.68) U5.4
$1N2818: length 1.6
  Top Layer w0.381: USB1.A5 16.66,9.1 arc(16.65,9.11) R18.2
$1N2825: length 1.6
  Top Layer w0.381: USB1.B5 19.66,9.11 arc(19.66,9.12) R19.1
$1N4156: length 1.4
  Top Layer w0.508: LED1.2 8.06,1.06 arc(8.05,1.06) R33.2
$1N4310: length 1.4
  Top Layer w0.508: R34.2 12.7,20.71 arc(12.71,20.69) LED2.2
$1N4943: length 1.8
  Top Layer w0.508: R35.1 27.64,1.05 arc(27.65,1.04) LED4.2
$1N4945: length 1.8
  Top Layer w0.508: R37.1 27.64,3.6 arc(27.65,3.6) LED6.2
$1N4947: length 1.8
  Top Layer w0.508: R36.1 27.65,6.15 arc(27.65,6.15) LED5.2

## Copper pours and planes (outline as drawn; the poured copper is in the pictures)
GND on Top Layer: -9.8,33.1 43.61,33.1 43.61,-2.74 -9.78,-2.74 -9.86,-2.82 -9.86,33.05
GND on Top Layer: -3.66,59.34 -3.66,32.9 40.15,32.9 40.15,59.44 -3.56,59.44
GND on Bottom Layer: -8.01,33 45.4,33 45.4,-2.84 -7.99,-2.84 -8.06,-2.91 -8.06,32.95
GND on Bottom Layer: -2.55,59.31 -2.55,32.87 41.26,32.87 41.26,59.41 -2.45,59.41
GND on Inner1: 0.26,55.62 35.3,55.62 35.3,0.26 0.26,0.26
GND on Inner2: -5.91,58.89 -5.91,-1.49 -5.8,-1.59 37.81,-1.59 37.91,-1.69 37.91,58.99 -5.8,58.99

## Text on the board
Bottom Silkscreen Layer: 2023.11.21 By Diam V0.1 | ESP32-S3-语音识别验证板 | D- | D+ | 5V | GND | IO4 | IO5 | IO6 | IO7 | IO8 | IO3 | IO9 | IO15 | IO16 | IO17 | IO18 | IO46 | IO10 | IO11 | IO12 | IO13 | IO1 | IO2 | 3V3 | TXD | RXD | IO42 | IO41 | IO40 | IO39 | IO38 | IO37 | IO36 | IO35 | IO0 | IO45 | IO48 | IO47 | IO21 | IO14
Top Silkscreen Layer: RGB💡 | DC-DC | RESET⚙ | ESP32-S3-WROOM-1U-N16R8 | 5V | MIC🎤 | IO47 | IO21 | IO14 | 3V3 | IO0->GND | ⚡
